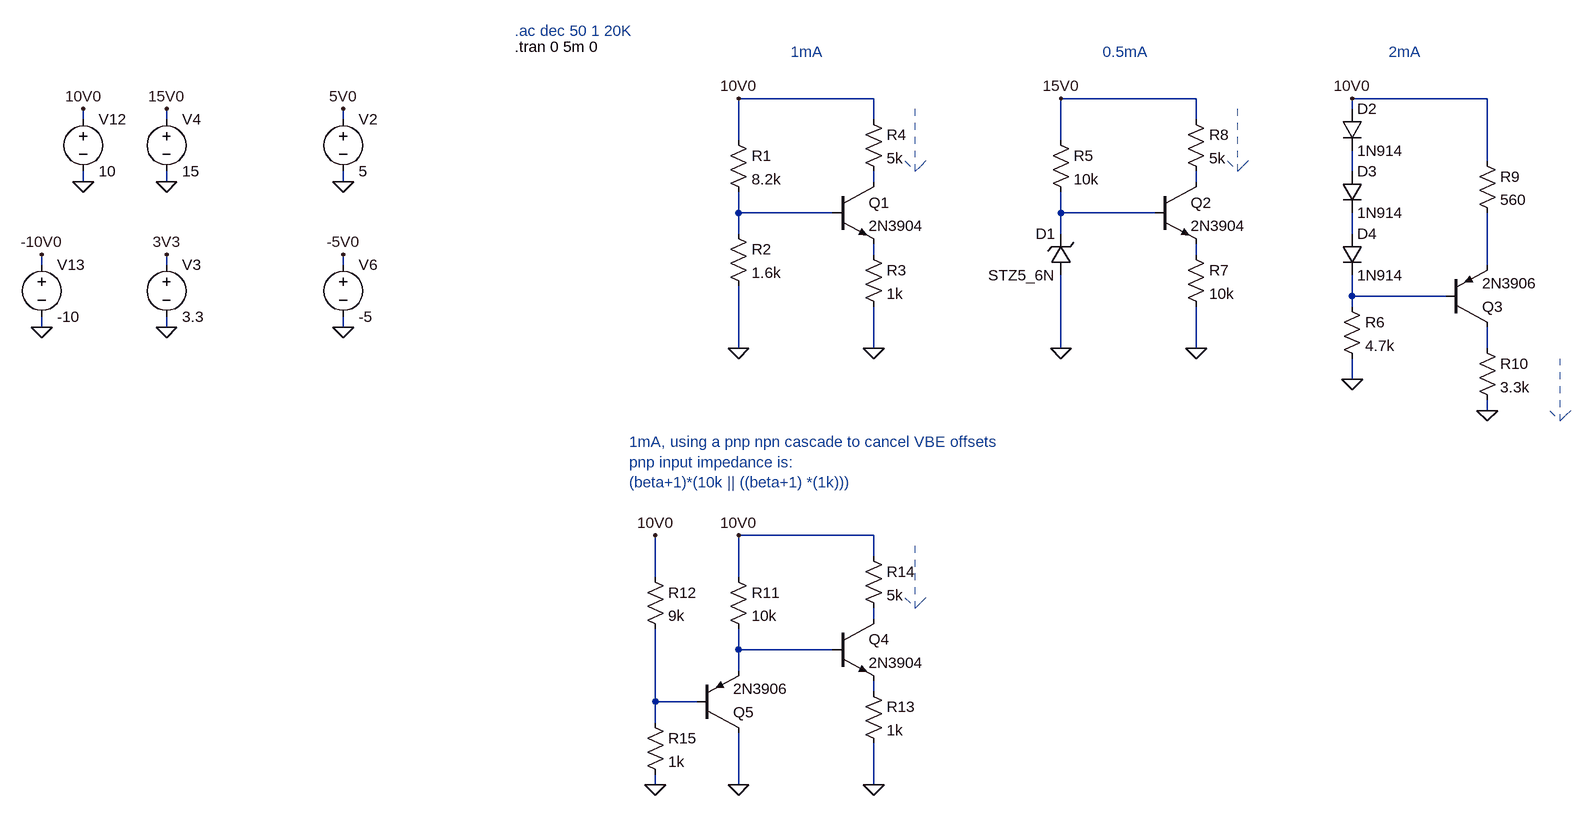
[diagram p0: schematic current source.asc]
current source.asc, the LTspice schematic file:
Version 4
SHEET 1 4136 1636
WIRE 480 352 272 352
WIRE 976 352 768 352
WIRE 1424 352 1216 352
WIRE 1216 368 1216 352
WIRE -736 384 -736 368
WIRE -608 384 -608 368
WIRE -336 384 -336 368
WIRE 480 384 480 352
WIRE 976 384 976 352
WIRE 272 416 272 352
WIRE 768 416 768 352
WIRE 1424 448 1424 352
WIRE 1216 464 1216 432
WIRE -736 480 -736 464
WIRE -608 480 -608 464
WIRE -336 480 -336 464
WIRE 480 480 480 464
WIRE 976 480 976 464
WIRE 272 528 272 496
WIRE 416 528 272 528
WIRE 768 528 768 496
WIRE 912 528 768 528
WIRE 272 560 272 528
WIRE 768 560 768 528
WIRE 1216 560 1216 528
WIRE 480 592 480 576
WIRE 976 592 976 576
WIRE -800 608 -800 592
WIRE -608 608 -608 592
WIRE -336 608 -336 592
WIRE 1424 608 1424 528
WIRE 1216 656 1216 624
WIRE 1360 656 1216 656
WIRE 1216 672 1216 656
WIRE -800 704 -800 688
WIRE -608 704 -608 688
WIRE -336 704 -336 688
WIRE 272 736 272 640
WIRE 480 736 480 672
WIRE 768 736 768 624
WIRE 976 736 976 672
WIRE 1424 736 1424 704
WIRE 1216 784 1216 752
WIRE 1424 832 1424 816
WIRE 480 1024 272 1024
WIRE 480 1056 480 1024
WIRE 144 1088 144 1024
WIRE 272 1088 272 1024
WIRE 480 1152 480 1136
WIRE 272 1200 272 1168
WIRE 416 1200 272 1200
WIRE 272 1232 272 1200
WIRE 480 1264 480 1248
WIRE 144 1280 144 1168
WIRE 208 1280 144 1280
WIRE 144 1312 144 1280
WIRE 144 1408 144 1392
WIRE 272 1408 272 1328
WIRE 480 1408 480 1344
FLAG -336 480 0
FLAG -336 368 5V0
FLAG -608 480 0
FLAG -608 368 15V0
FLAG -336 704 0
FLAG -336 592 -5V0
FLAG -608 704 0
FLAG -608 592 3V3
FLAG -736 480 0
FLAG -736 368 10V0
FLAG -800 704 0
FLAG -800 592 -10V0
FLAG 272 352 10V0
FLAG 272 736 0
FLAG 480 736 0
FLAG 768 352 15V0
FLAG 768 736 0
FLAG 976 736 0
FLAG 1216 784 0
FLAG 1216 352 10V0
FLAG 1424 832 0
FLAG 272 1024 10V0
FLAG 480 1408 0
FLAG 272 1408 0
FLAG 144 1024 10V0
FLAG 144 1408 0
SYMBOL voltage -336 368 R0
WINDOW 123 0 0 Left 0
WINDOW 39 0 0 Left 0
SYMATTR InstName V2
SYMATTR Value 5
SYMBOL voltage -608 368 R0
WINDOW 123 0 0 Left 0
WINDOW 39 0 0 Left 0
SYMATTR InstName V4
SYMATTR Value 15
SYMBOL voltage -336 592 R0
WINDOW 123 0 0 Left 0
WINDOW 39 0 0 Left 0
SYMATTR InstName V6
SYMATTR Value -5
SYMBOL voltage -608 592 R0
WINDOW 123 0 0 Left 0
WINDOW 39 0 0 Left 0
SYMATTR InstName V3
SYMATTR Value 3.3
SYMBOL voltage -736 368 R0
WINDOW 123 0 0 Left 0
WINDOW 39 0 0 Left 0
SYMATTR InstName V12
SYMATTR Value 10
SYMBOL voltage -800 592 R0
WINDOW 123 0 0 Left 0
WINDOW 39 0 0 Left 0
SYMATTR InstName V13
SYMATTR Value -10
SYMBOL res 256 400 R0
SYMATTR InstName R1
SYMATTR Value 8.2k
SYMBOL res 256 544 R0
SYMATTR InstName R2
SYMATTR Value 1.6k
SYMBOL npn 416 480 R0
SYMATTR InstName Q1
SYMATTR Value 2N3904
SYMBOL res 464 576 R0
SYMATTR InstName R3
SYMATTR Value 1k
SYMBOL res 464 368 R0
SYMATTR InstName R4
SYMATTR Value 5k
SYMBOL res 752 400 R0
SYMATTR InstName R5
SYMATTR Value 10k
SYMBOL npn 912 480 R0
SYMATTR InstName Q2
SYMATTR Value 2N3904
SYMBOL res 960 576 R0
SYMATTR InstName R7
SYMATTR Value 10k
SYMBOL res 960 368 R0
SYMATTR InstName R8
SYMATTR Value 5k
SYMBOL zener 784 624 R180
WINDOW 0 24 64 Left 2
WINDOW 3 24 0 Left 2
SYMATTR InstName D1
SYMATTR Value STZ5_6N
SYMATTR Description Diode
SYMATTR Type diode
SYMBOL diode 1200 368 R0
SYMATTR InstName D2
SYMATTR Value 1N914
SYMBOL diode 1200 464 R0
SYMATTR InstName D3
SYMATTR Value 1N914
SYMBOL diode 1200 560 R0
SYMATTR InstName D4
SYMATTR Value 1N914
SYMBOL res 1200 656 R0
SYMATTR InstName R6
SYMATTR Value 4.7k
SYMBOL pnp 1360 704 M180
SYMATTR InstName Q3
SYMATTR Value 2N3906
SYMBOL res 1408 432 R0
SYMATTR InstName R9
SYMATTR Value 560
SYMBOL res 1408 720 R0
SYMATTR InstName R10
SYMATTR Value 3.3k
SYMBOL res 256 1072 R0
SYMATTR InstName R11
SYMATTR Value 10k
SYMBOL npn 416 1152 R0
SYMATTR InstName Q4
SYMATTR Value 2N3904
SYMBOL res 464 1248 R0
SYMATTR InstName R13
SYMATTR Value 1k
SYMBOL res 464 1040 R0
SYMATTR InstName R14
SYMATTR Value 5k
SYMBOL pnp 208 1328 M180
SYMATTR InstName Q5
SYMATTR Value 2N3906
SYMBOL res 128 1072 R0
SYMATTR InstName R12
SYMATTR Value 9k
SYMBOL res 128 1296 R0
SYMATTR InstName R15
SYMATTR Value 1k
TEXT -72 248 Left 2 ;.ac dec 50 1 20K
TEXT -72 272 Left 2 !.tran 0 5m 0
TEXT 352 280 Left 2 ;1mA
TEXT 832 280 Left 2 ;0.5mA
TEXT 1272 280 Left 2 ;2mA
TEXT 104 880 Left 2 ;1mA, using a pnp npn cascade to cancel VBE offsets\npnp input impedance is:\n(beta+1)*(10k || ((beta+1) *(1k)))
LINE Normal 544 464 544 368 2
LINE Normal 544 464 544 464 2
LINE Normal 560 448 544 464 2
LINE Normal 544 464 560 448 2
LINE Normal 528 448 544 464 2
LINE Normal 1040 464 1040 368 2
LINE Normal 1040 464 1040 464 2
LINE Normal 1056 448 1040 464 2
LINE Normal 1040 464 1056 448 2
LINE Normal 1024 448 1040 464 2
LINE Normal 1536 848 1536 752 2
LINE Normal 1536 848 1536 848 2
LINE Normal 1552 832 1536 848 2
LINE Normal 1536 848 1552 832 2
LINE Normal 1520 832 1536 848 2
LINE Normal 544 1136 544 1040 2
LINE Normal 544 1136 544 1136 2
LINE Normal 560 1120 544 1136 2
LINE Normal 544 1136 560 1120 2
LINE Normal 528 1120 544 1136 2

The netlist it stands for:
* current source.asc
V2 5V0 0 5
V4 15V0 0 15
V6 -5V0 0 -5
V3 3V3 0 3.3
V12 10V0 0 10
V13 -10V0 0 -10
R1 10V0 N004 8.2k
R2 N004 0 1.6k
Q1 N002 N004 N007 0 2N3904
R3 N007 0 1k
R4 10V0 N002 5k
R5 15V0 N005 10k
Q2 N003 N005 N008 0 2N3904
R7 N008 0 10k
R8 15V0 N003 5k
D1 0 N005 STZ5_6N
D2 10V0 N001 1N914
D3 N001 N006 1N914
D4 N006 N010 1N914
R6 N010 0 4.7k
Q3 N011 N010 N009 0 2N3906
R9 10V0 N009 560
R10 N011 0 3.3k
R11 10V0 N013 10k
Q4 N012 N013 N014 0 2N3904
R13 N014 0 1k
R14 10V0 N012 5k
Q5 0 N015 N013 0 2N3906
R12 10V0 N015 9k
R15 N015 0 1k
.model D D
.lib standard.dio
.model NPN NPN
.model PNP PNP
.lib standard.bjt
* .ac dec 50 1 20K
.tran 0 5m 0
* 1mA
* 0.5mA
* 2mA
* 1mA, using a pnp npn cascade to cancel VBE offsets
* pnp input impedance is:
* (beta+1)*(10k || ((beta+1) *(1k)))
.backanno
.end